# EAGLE design SRC_1_0 (EAGLE 7.6.0)
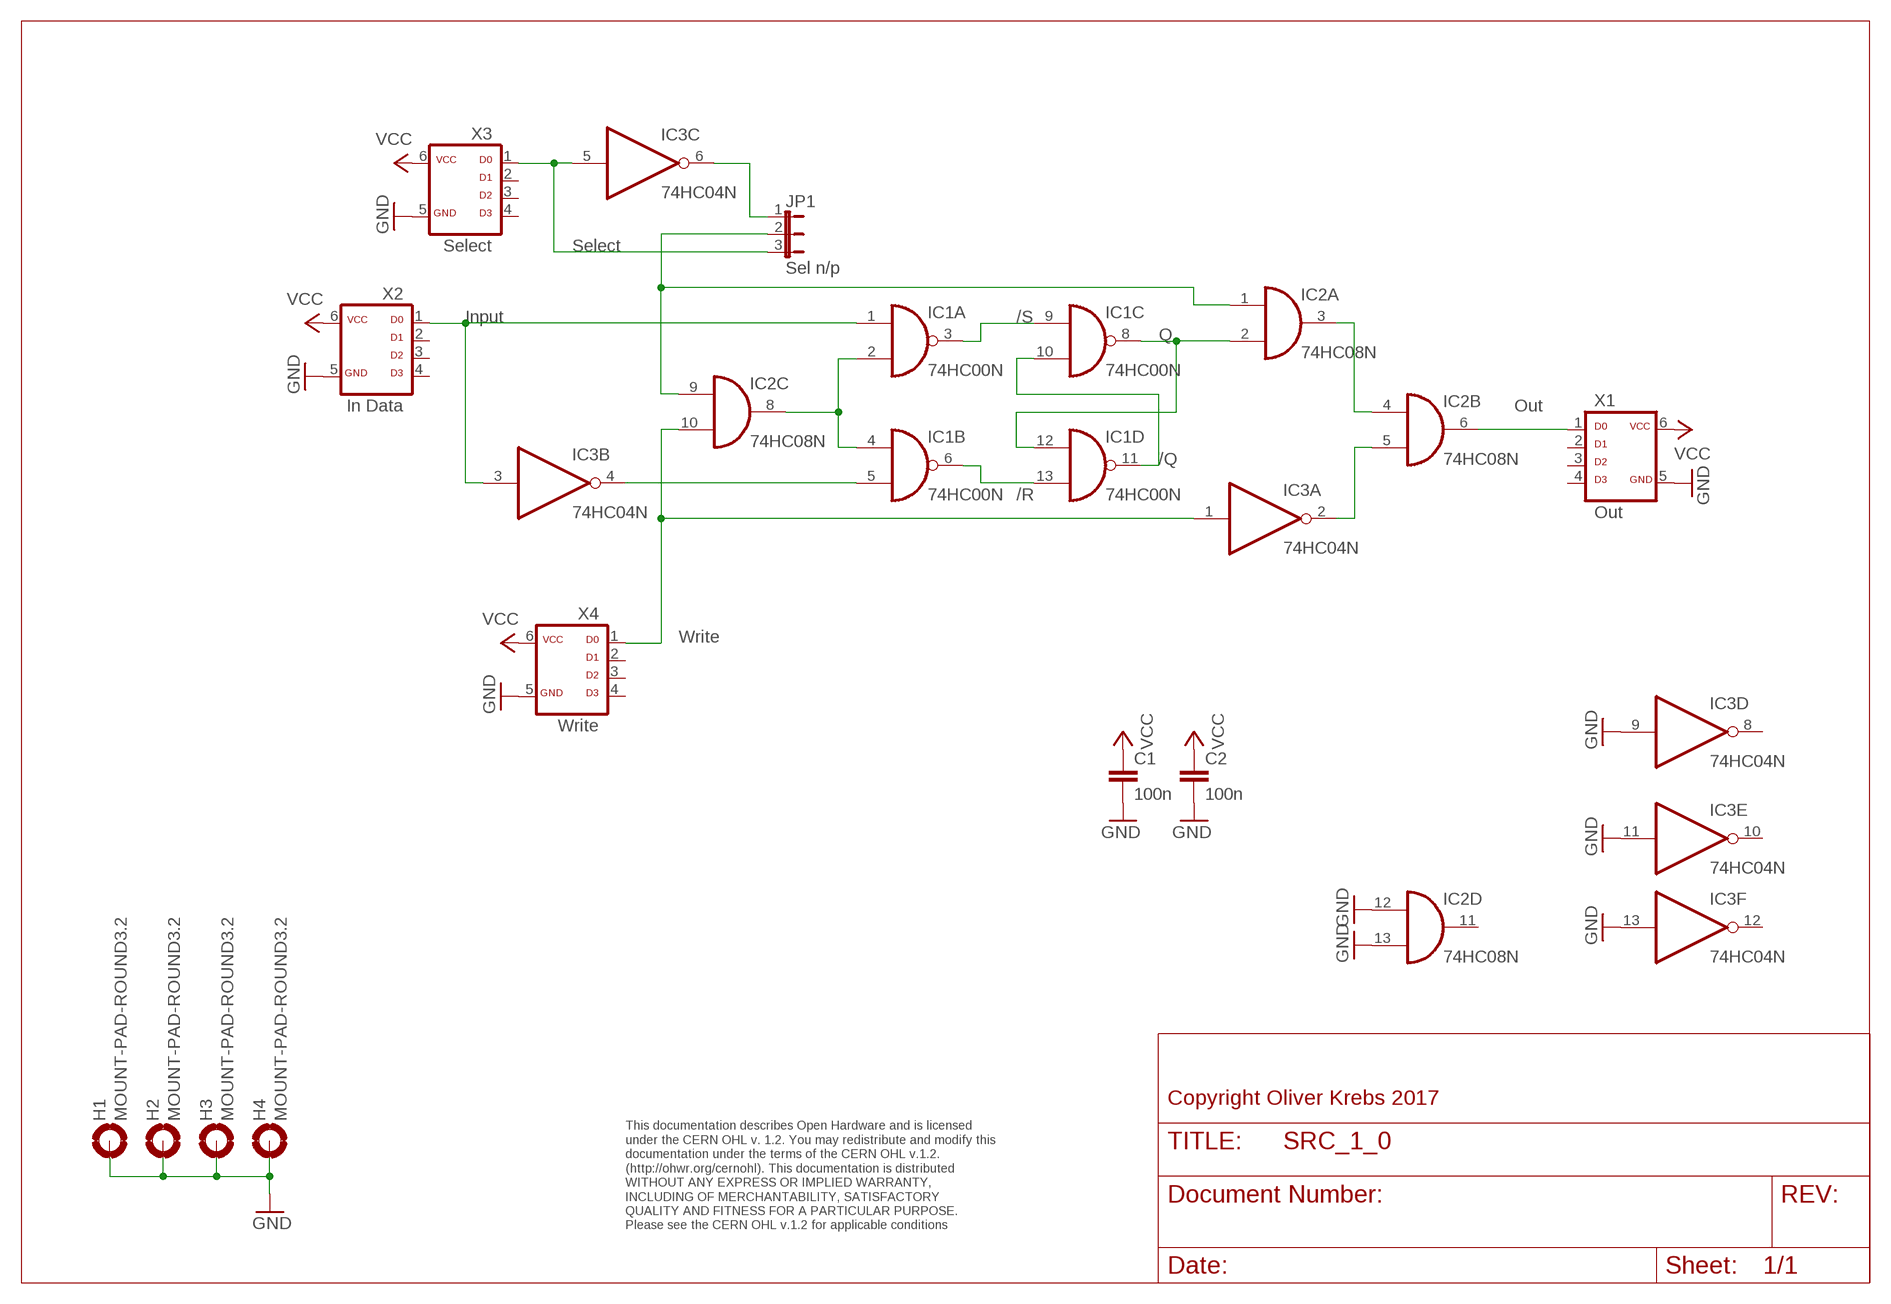
[diagram p0: schematic, sheet 1]

## Parts
C1  100n  C-EU050-030X075  [C050-030X075]
C2  100n  C-EU050-030X075  [C050-030X075]
H1  MOUNT-PAD-ROUND3.2  [3,2-PAD]
H2  MOUNT-PAD-ROUND3.2  [3,2-PAD]
H3  MOUNT-PAD-ROUND3.2  [3,2-PAD]
H4  MOUNT-PAD-ROUND3.2  [3,2-PAD]
IC1  74HC00N  [DIL14]
IC2  74HC08N  [DIL14]
IC3  74HC04N  [DIL14]
JP1  Sel n/p  JP2EJP2-U  [JP2-U]
X1  Out  ML6D  [ML-6]
X2  In Data  ML6D  [ML-6]
X3  Select  ML6D  [ML-6]
X4  Write  ML6D  [ML-6]

## Nets
GND: C1.2 C2.2 H1.B3,2(MOUNT) H2.B3,2(MOUNT) H3.B3,2(MOUNT) H4.B3,2(MOUNT) IC2.12(D:I0) IC2.13(D:I1) IC3.9(D:I) IC3.11(E:I) IC3.13(F:I) X1.5 X2.5 X3.5 X4.5
N$1: IC2.3(A:O) IC2.4(B:I0)
N$2: IC1.2(A:I1) IC1.4(B:I0) IC2.8(C:O)
N$3: IC1.1(A:I0) IC3.3(B:I) X2.1
N$4: IC2.1(A:I0) IC2.9(C:I0) JP1.2
N$5: IC2.10(C:I1) IC3.1(A:I) X4.1
N$6: IC1.3(A:O) IC1.9(C:I0)
N$7: IC1.6(B:O) IC1.13(D:I1)
N$8: IC1.8(C:O) IC1.12(D:I0) IC2.2(A:I1)
N$9: IC1.5(B:I1) IC3.4(B:O)
N$10: IC1.10(C:I1) IC1.11(D:O)
N$11: IC2.6(B:O) X1.1
N$12: IC2.5(B:I1) IC3.2(A:O)
N$13: IC3.6(C:O) JP1.1
N$14: IC3.5(C:I) JP1.3 X3.1
VCC: C1.1 C2.1 X1.6 X2.6 X3.6 X4.6
Unconnected: IC2.11(D:O) IC3.8(D:O) IC3.10(E:O) IC3.12(F:O) X1.2 X1.3 X1.4 X2.2 X2.3 X2.4 X3.2 X3.3 X3.4 X4.2 X4.3 X4.4

## Notes on the sheet
- Select
- Input | /S
- Q
- Out
- /Q
- /R
- Write
- Copyright Oliver Krebs 2017
- This documentation describes Open Hardware and is licensed 
  under the CERN OHL v. 1.2. You may redistribute and modify this 
  documentation under the terms of the CERN OHL v.1.2. 
  (http://ohwr.org/cernohl). This documentation is distributed
  WITHOUT ANY EXPRESS OR IMPLIED WARRANTY, 
  INCLUDING OF MERCHANTABILITY, SATISFACTORY 
  QUALITY AND FITNESS FOR A PARTICULAR PURPOSE. 
  Please see the CERN OHL v.1.2 for applicable conditions

## Power pins joined to a net without a drawn wire
GND: IC1.7(P:GND) IC2.7(P:GND) IC3.7(P:GND)
VCC: IC1.14(P:VCC) IC2.14(P:VCC) IC3.14(P:VCC)

## Library data of the parts
C1 C2 = 01-my_rcl:C-EU: CAPACITOR, European symbol
H1-H4 = holes:MOUNT-PAD-ROUND: MOUNTING PAD, round
IC1 = 74xx-eu:74*00: Quad 2-input NAND gate
IC2 = 74xx-eu:74*08: Quad 2-input AND gate
IC3 = 74xx-eu:74*04: Hex INVERTER
JP1 = 01-my-jumper:JP2E: JUMPER
X1-X4 = 01-my-con:ML6D

## Board
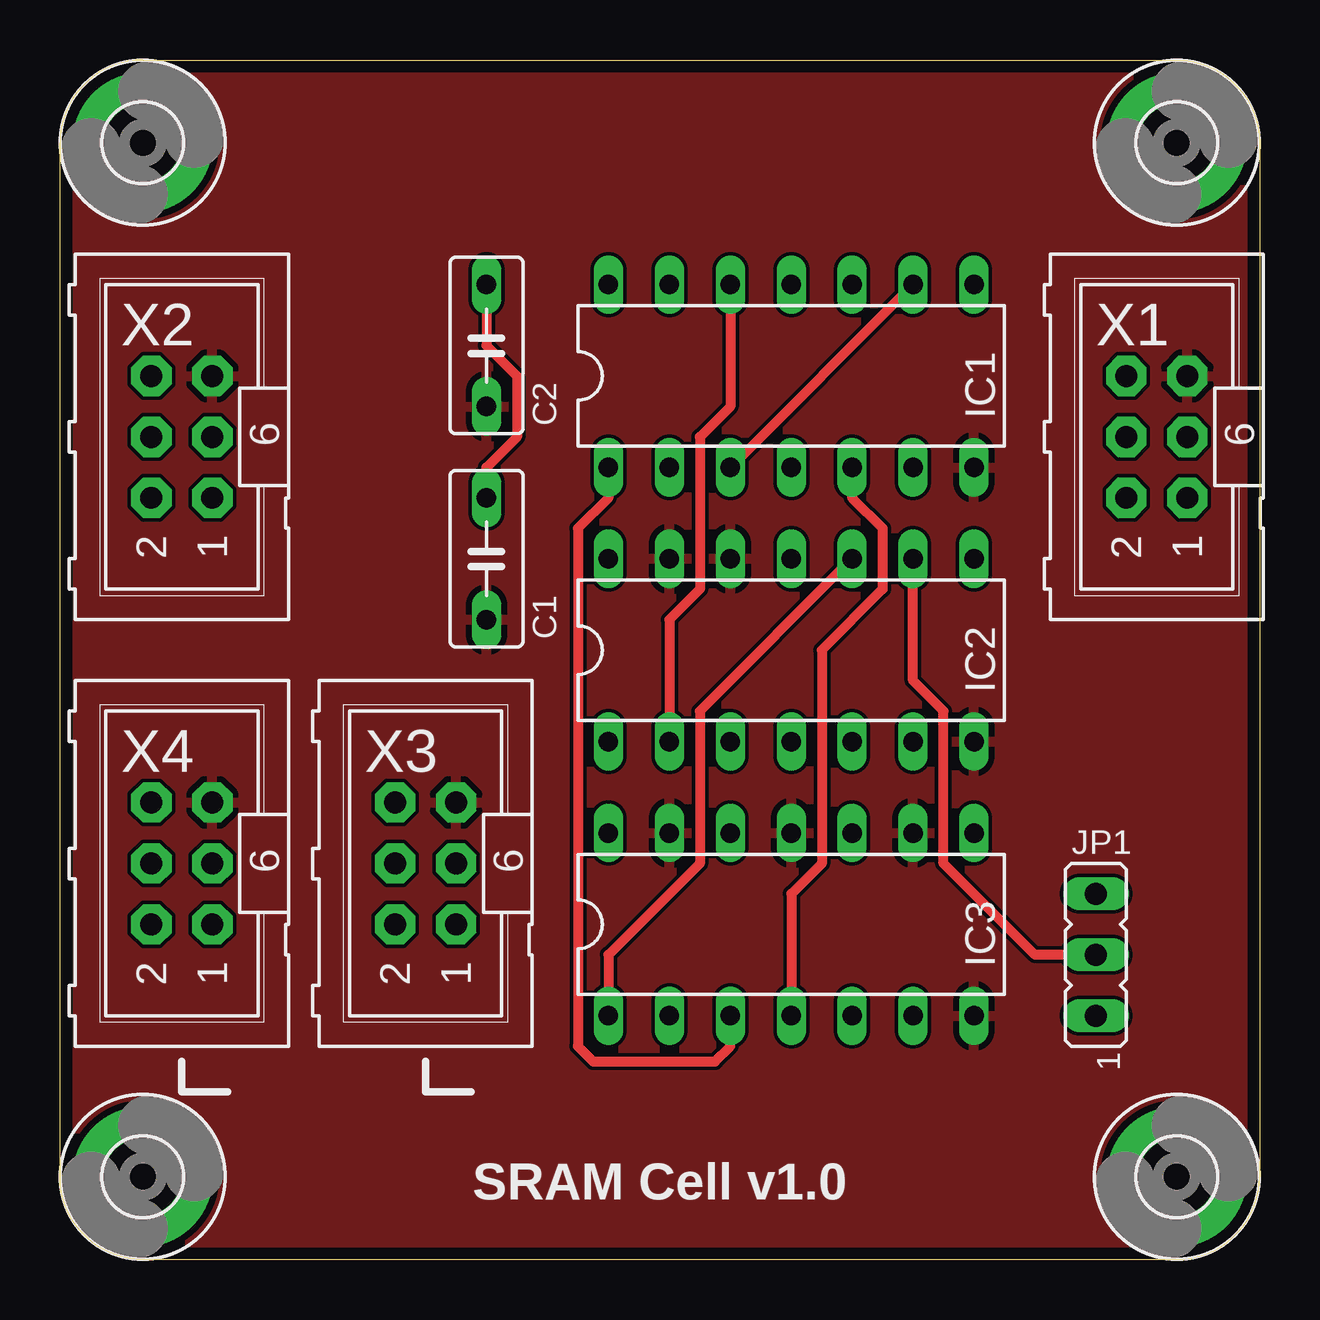
[diagram p1: board, top side]
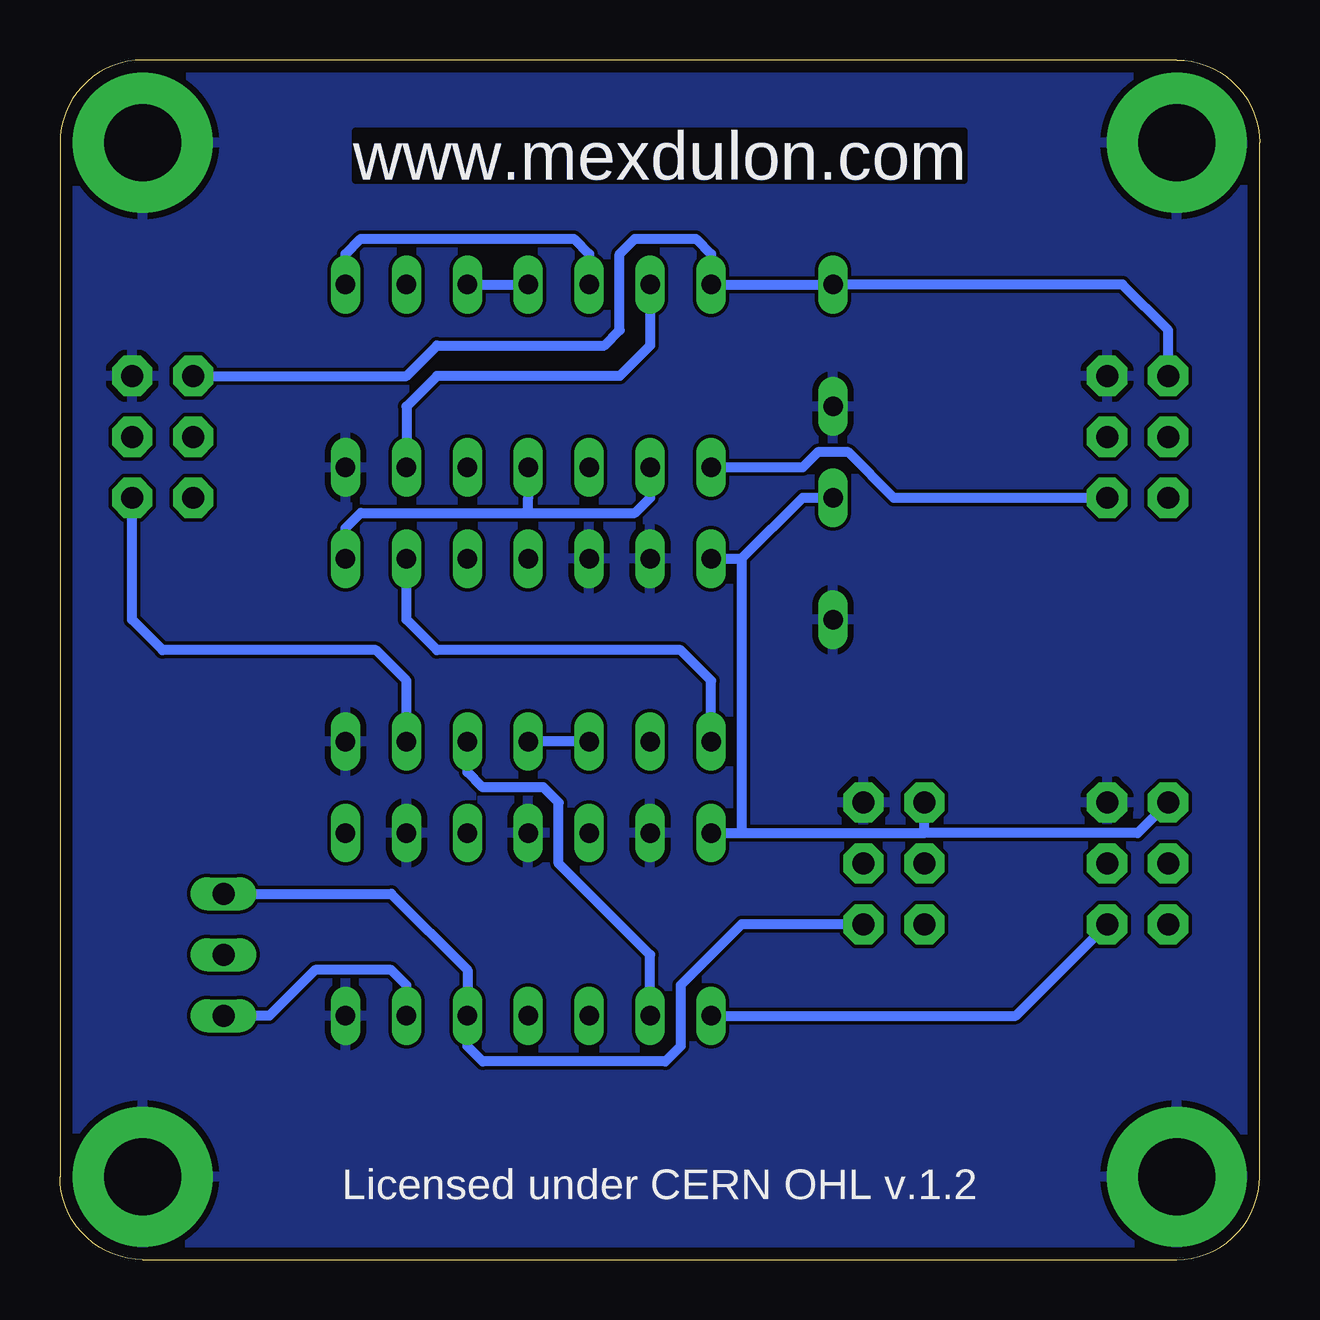
[diagram p2: board, bottom side, seen from below]

Size 50 x 50 mm. Coordinates in mm from the lower left corner, seen from the top.
Outline: 0,3.45 0,46.55 arc-90 3.45,50 46.55,50 arc-90 50,46.55 50,3.45 arc-90 46.55,0 3.45,0 arc-90 0,3.45
Copper layers (1*16): Top 0.035mm / dielectric 1.6mm / Bottom 0.035mm
Design rules "Elecrow_2-layer_PCB_eagle_rule": minimum track width 6mil, minimum drill 12mil, track to track 6mil, track to pad 6mil, pad to pad 6mil, via to via 8mil, smd to smd 0mil, copper to edge 20mil, drill to drill 10mil, minimum pad ring 6mil, minimum via ring 6mil, stop-mask expansion 0mil, vias tented up to drill 100mil, thermal gap 10mil

### Footprints (pad centres in the part's own frame; a part is rotated, then mirrored left to right if it is on the bottom)
C050-030X075 = drill 0.813 long: 1 -2.54,0; 2 2.54,0
3,2-PAD = drill 3.2 pad 5.842: B3,2 0,0
DIL14 = drill 0.813 long: 1 -7.62,-3.81; 2 -5.08,-3.81; 3 -2.54,-3.81; 4 0,-3.81; 5 2.54,-3.81; 6 5.08,-3.81; 7 7.62,-3.81; 8 7.62,3.81; 9 5.08,3.81; 10 2.54,3.81; 11 0,3.81; 12 -2.54,3.81; 13 -5.08,3.81; 14 -7.62,3.81
JP2-U = drill 0.914 long: 1 -2.54,0; 2 0,0; 3 2.54,0
ML-6 = drill 0.914 pad 1.676 octagon: 1 -2.54,-1.27; 2 -2.54,1.27; 3 0,-1.27; 4 0,1.27; 5 2.54,-1.27; 6 2.54,1.27

### Placement (x,y rotation side)
C1  17.78,29.21 270 top
C2  17.78,38.1 270 top
H1  3.45,3.45 0 top
H2  3.45,46.55 0 top
H3  46.55,3.45 0 top
H4  46.55,46.55 0 top
IC1  30.48,36.83 0 top
IC2  30.48,25.4 0 top
IC3  30.48,13.97 0 top
JP1  43.18,12.7 90 top
X1  45.72,34.29 90 top
X2  5.08,34.29 90 top
X3  15.24,16.51 90 top
X4  5.08,16.51 90 top

### Tracks (layer width: path | path; a pad name or v marks a point on that pad's centre or on a via)
GND
  pour Bottom: 0,0 50.8,0 50.8,50.8 0,50.8
  pour Top: 0,50.16 50.16,50.16 50.16,0 0,0
N$1
  Bottom 0.406: IC2.3 IC2.4
N$2
  Bottom 0.406: IC1.4 30.48,31.75 30.48,31.11 | 30.48,31.11 26.04,31.11 25.4,31.75 IC1.2 | IC2.8 38.1,30.48 37.47,31.11 30.48,31.11
N$3
  Top 0.406: IC1.1 22.86,31.75 21.59,30.48 21.59,8.89 22.23,8.26 27.3,8.26 27.94,8.89 IC3.3
  Bottom 0.406: X2.1 15.24,31.75 17.14,33.66 18.41,33.66 19.05,33.02 IC1.1
N$4
  Top 0.406: JP1.2 40.64,12.7 36.83,16.51 36.83,22.86 35.56,24.13 IC2.9
  Bottom 0.406: IC2.1 22.86,24.13 24.13,25.4 34.29,25.4 35.56,26.67 IC2.9
N$5
  Top 0.406: IC2.10 26.67,22.86 26.67,16.51 22.86,12.7 IC3.1
  Bottom 0.406: IC3.1 10.16,10.16 X4.1
N$6
  Top 0.406: IC1.9 IC1.3
N$7
  Bottom 0.406: IC1.13 25.4,38.1 26.67,36.83 34.29,36.83 35.56,35.56 IC1.6
N$8
  Top 0.406: IC1.12 27.94,35.56 26.67,34.29 26.67,27.94 25.4,26.67 IC2.2
  Bottom 0.406: IC1.8 38.1,41.91 37.47,42.55 28.57,42.55 27.94,41.91 IC1.12
N$9
  Top 0.406: IC1.5 33.02,31.75 34.29,30.48 34.29,27.94 31.75,25.4 31.75,16.51 30.48,15.24 IC3.4
N$10
  Bottom 0.406: IC1.10 IC1.11
N$11
  Bottom 0.406: IC2.6 35.56,24.13 36.83,25.4 45.72,25.4 46.99,26.67 X1.1
N$12
  Bottom 0.406: IC3.2 25.4,12.7 29.21,16.51 29.21,19.05 29.84,19.68 32.38,19.68 33.02,20.32 IC2.5
N$13
  Bottom 0.406: IC3.6 35.56,11.43 36.2,12.06 39.37,12.06 41.27,10.16 JP1.1
N$14
  Bottom 0.406: X3.1 21.59,13.97 24.13,11.43 24.13,8.89 24.77,8.26 32.38,8.26 33.02,8.89 IC3.5 33.02,12.06 36.2,15.24 JP1.3
VCC
  Top 0.406: C2.1 17.78,38.1 19.05,36.83 19.05,34.29 17.78,33.02 C1.1
  Bottom 0.406: X2.6 3.81,38.73 5.71,40.64 C2.1 IC1.14 22.86,41.91 23.5,42.55 26.04,42.55 26.67,41.91 26.67,38.73 27.3,38.1 34.29,38.1 35.56,36.83 X1.6 | IC3.14 21.59,17.78 | 21.59,17.78 13.97,17.78 | X4.6 5.08,17.78 13.97,17.78 | 13.97,17.78 X3.6 | C1.1 19.05,31.75 21.59,29.21 | IC2.14 21.59,29.21 | 21.59,29.21 21.59,17.78

### Text on the board
Bottom: www.mexdulon.com
tNames: SRAM Cell v1.0
bNames: www.mexdulon.com | Licensed under CERN OHL v.1.2